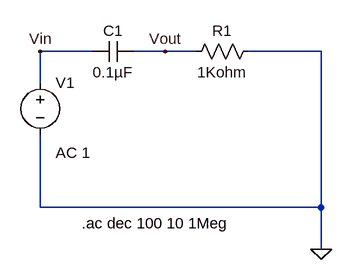
[diagram p0: schematic high pass filter.asc]
high pass filter.asc, the LTspice schematic file:
Version 4.1
SHEET 1 880 680
WIRE 64 144 -16 144
WIRE 176 144 128 144
WIRE 224 144 176 144
WIRE 416 144 304 144
WIRE -16 192 -16 144
WIRE -16 384 -16 272
WIRE 416 384 416 144
WIRE 416 384 -16 384
WIRE 416 448 416 384
FLAG 416 448 0
FLAG 176 144 Vout
FLAG -16 144 Vin
SYMBOL cap 128 128 R90
WINDOW 0 0 32 VBottom 2
WINDOW 3 32 32 VTop 2
SYMATTR InstName C1
SYMATTR Value 0.1µF
SYMBOL res 320 128 R90
WINDOW 0 0 56 VBottom 2
WINDOW 3 32 56 VTop 2
SYMATTR InstName R1
SYMATTR Value 1Kohm
SYMBOL voltage -16 176 R0
WINDOW 123 24 124 Left 2
WINDOW 39 0 0 Left 0
SYMATTR InstName V1
SYMATTR Value ""
SYMATTR Value2 AC 1
TEXT 48 408 Left 2 !.ac dec 100 10 1Meg

The netlist it stands for:
* high pass filter.asc
C1 Vout Vin 0.1µF
R1 0 Vout 1Kohm
V1 Vin 0 AC 1
.ac dec 100 10 1Meg
.backanno
.end